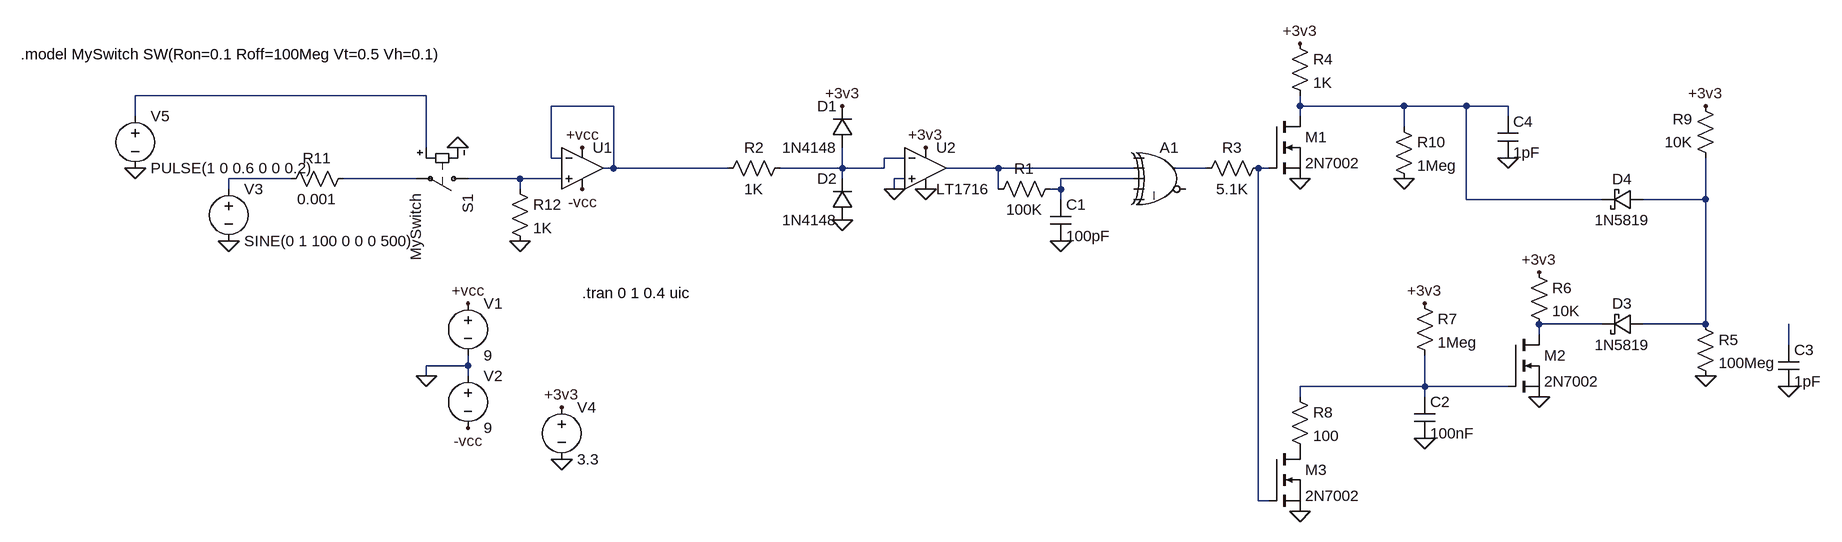
[diagram p0: schematic Revised Zero Crossing Detector.asc]
Revised Zero Crossing Detector.asc, the LTspice schematic file:
Version 4
SHEET 1 2064 932
WIRE -112 208 -560 208
WIRE 176 224 80 224
WIRE 1232 224 1232 208
WIRE 1392 224 1232 224
WIRE 1488 224 1392 224
WIRE 1552 224 1488 224
WIRE -560 240 -560 208
WIRE 1232 240 1232 224
WIRE 1552 240 1552 224
WIRE 1392 256 1392 224
WIRE -112 288 -112 208
WIRE 80 304 80 224
WIRE 96 304 80 304
WIRE 624 304 592 304
WIRE 176 320 176 224
WIRE 176 320 160 320
WIRE 352 320 176 320
WIRE 528 320 528 288
WIRE 528 320 432 320
WIRE 592 320 592 304
WIRE 592 320 528 320
WIRE 768 320 688 320
WIRE 976 320 768 320
WIRE 1088 320 1040 320
WIRE 1184 320 1168 320
WIRE -320 336 -416 336
WIRE -128 336 -240 336
WIRE 32 336 -48 336
WIRE 96 336 32 336
WIRE 528 336 528 320
WIRE 624 336 608 336
WIRE 976 336 864 336
WIRE -416 352 -416 336
WIRE 32 352 32 336
WIRE 608 352 608 336
WIRE 768 352 768 320
WIRE 864 352 864 336
WIRE 864 352 848 352
WIRE 864 368 864 352
WIRE 1488 368 1488 224
WIRE 1696 368 1488 368
WIRE 1856 368 1856 304
WIRE 1856 368 1760 368
WIRE 1696 560 1600 560
WIRE 1856 560 1856 368
WIRE 1856 560 1760 560
WIRE 1600 576 1600 560
WIRE 1984 592 1984 560
WIRE -48 624 -48 608
WIRE -48 624 -112 624
WIRE -112 640 -112 624
WIRE -48 640 -48 624
WIRE 1424 656 1424 608
WIRE 1424 656 1232 656
WIRE 1552 656 1424 656
WIRE 1232 672 1232 656
WIRE 1424 672 1424 656
WIRE 1168 832 1168 320
WIRE 1184 832 1168 832
FLAG -112 640 0
FLAG -48 528 +vcc
FLAG -48 720 -vcc
FLAG 128 352 -vcc
FLAG 128 288 +vcc
FLAG 608 352 0
FLAG -416 432 0
FLAG 96 768 0
FLAG 96 688 +3v3
FLAG 864 432 0
FLAG 528 400 0
FLAG 528 224 +3v3
FLAG 1232 336 0
FLAG 1232 128 +3v3
FLAG 656 352 0
FLAG 656 288 +3v3
FLAG 1424 736 0
FLAG 1600 672 0
FLAG 1600 480 +3v3
FLAG 1424 528 +3v3
FLAG 1232 848 0
FLAG 1856 224 +3v3
FLAG 1856 640 0
FLAG 1984 656 0
FLAG 1392 336 0
FLAG 1552 304 0
FLAG -560 320 0
FLAG -64 288 0
FLAG 32 432 0
SYMBOL OpAmps/UniversalOpAmp2 128 320 R0
SYMATTR InstName U1
SYMBOL Comparators/LT1716 656 320 R0
SYMATTR InstName U2
SYMBOL voltage -48 512 R0
SYMATTR InstName V1
SYMATTR Value 9
SYMBOL voltage -48 624 R0
SYMATTR InstName V2
SYMATTR Value 9
SYMBOL voltage -416 336 R0
SYMATTR InstName V3
SYMATTR Value SINE(0 1 100 0 0 0 500)
SYMATTR Value2 AC 1
SYMBOL Digital/xor 1024 272 R0
WINDOW 3 16 46 Left 2
SYMATTR InstName A1
SYMATTR SpiceLine Vhigh=3.3
SYMBOL voltage 96 672 R0
SYMATTR InstName V4
SYMATTR Value 3.3
SYMBOL Res 864 336 R90
WINDOW 0 0 56 VBottom 2
WINDOW 3 32 56 VTop 2
SYMATTR InstName R1
SYMATTR Value 100K
SYMBOL Cap 848 368 R0
SYMATTR InstName C1
SYMATTR Value 100pF
SYMBOL diode 544 288 R180
WINDOW 0 24 64 Left 2
WINDOW 3 24 0 Left 2
SYMATTR InstName D1
SYMATTR Value 1N4148
SYMBOL diode 544 400 R180
WINDOW 0 24 64 Left 2
WINDOW 3 24 0 Left 2
SYMATTR InstName D2
SYMATTR Value 1N4148
SYMBOL Res 448 304 R90
WINDOW 0 0 56 VBottom 2
WINDOW 3 32 56 VTop 2
SYMATTR InstName R2
SYMATTR Value 1K
SYMBOL nmos 1184 240 R0
SYMATTR InstName M1
SYMATTR Value 2N7002
SYMBOL Res 1216 112 R0
SYMATTR InstName R4
SYMATTR Value 1K
SYMBOL Res 1184 304 R90
WINDOW 0 0 56 VBottom 2
WINDOW 3 32 56 VTop 2
SYMATTR InstName R3
SYMATTR Value 5.1K
SYMBOL Cap 1408 672 R0
SYMATTR InstName C2
SYMATTR Value 100nF
SYMBOL Res 1584 464 R0
SYMATTR InstName R6
SYMATTR Value 10K
SYMBOL nmos 1552 576 R0
SYMATTR InstName M2
SYMATTR Value 2N7002
SYMBOL Res 1408 512 R0
SYMATTR InstName R7
SYMATTR Value 1Meg
SYMBOL nmos 1184 752 R0
SYMATTR InstName M3
SYMATTR Value 2N7002
SYMBOL Res 1216 656 R0
SYMATTR InstName R8
SYMATTR Value 100
SYMBOL schottky 1760 544 R90
WINDOW 0 0 32 VBottom 2
WINDOW 3 32 32 VTop 2
SYMATTR InstName D3
SYMATTR Value 1N5819
SYMATTR Description Diode
SYMATTR Type diode
SYMBOL Res 1872 320 R180
WINDOW 0 36 76 Left 2
WINDOW 3 36 40 Left 2
SYMATTR InstName R9
SYMATTR Value 10K
SYMBOL schottky 1760 352 R90
WINDOW 0 0 32 VBottom 2
WINDOW 3 32 32 VTop 2
SYMATTR InstName D4
SYMATTR Value 1N5819
SYMATTR Description Diode
SYMATTR Type diode
SYMBOL Res 1840 544 R0
SYMATTR InstName R5
SYMATTR Value 100Meg
SYMBOL Cap 1968 592 R0
SYMATTR InstName C3
SYMATTR Value 1pF
SYMBOL Res 1376 240 R0
SYMATTR InstName R10
SYMATTR Value 1Meg
SYMBOL Cap 1536 240 R0
SYMATTR InstName C4
SYMATTR Value 1pF
SYMBOL Res -224 320 R90
WINDOW 0 0 56 VBottom 2
WINDOW 3 32 56 VTop 2
SYMATTR InstName R11
SYMATTR Value 0.001
SYMBOL sw -32 336 R90
SYMATTR InstName S1
SYMATTR Value MySwitch
SYMBOL voltage -560 224 R0
SYMATTR InstName V5
SYMATTR Value PULSE(1 0 0.6 0 0 0.2)
SYMBOL Res 16 336 R0
SYMATTR InstName R12
SYMATTR Value 1K
TEXT 128 512 Left 2 !.tran 0 1 0.4 uic
TEXT -736 144 Left 2 !.model MySwitch SW(Ron=0.1 Roff=100Meg Vt=0.5 Vh=0.1)

The netlist it stands for:
* Revised Zero Crossing Detector.asc
XU1 N010 N002 +vcc -vcc N002 level2 Avol=1Meg GBW=10Meg Slew=10Meg Ilimit=25m Rail=0 Vos=0 En=0 Enk=0 In=0 Ink=0 Rin=500Meg  ; pins In+ In- V+ V- OUT
XU2 0 N004 +3v3 0 N005 LT1716  ; pins In+ In- V+ V- OUT
V1 +vcc 0 9
V2 0 -vcc 9
V3 N008 0 SINE(0 1 100 0 0 0 500) AC 1
A1 0 N005 N011 0 0 0 N006 0 XOR Vhigh=3.3
V4 +3v3 0 3.3
R1 N011 N005 100K
C1 N011 0 100pF
D1 N004 +3v3 1N4148
D2 0 N004 1N4148
R2 N004 N002 1K
M1 N003 N007 0 0 2N7002
R4 +3v3 N003 1K
R3 N007 N006 5.1K
C2 N015 0 100nF
R6 +3v3 N013 10K
M2 N013 N015 0 0 2N7002
R7 +3v3 N015 1Meg
M3 P001 N007 0 0 2N7002
R8 N015 P001 100
D3 N012 N013 1N5819
R9 N012 +3v3 10K
D4 N012 N003 1N5819
R5 N012 0 100Meg
C3 N014 0 1pF
R10 N003 0 1Meg
C4 N003 0 1pF
R11 N009 N008 0.001
S1 N010 N009 N001 0 MySwitch
V5 N001 0 PULSE(1 0 0.6 0 0 0.2)
R12 N010 0 1K
.model D D
.lib standard.dio
.model NMOS NMOS
.model PMOS PMOS
.lib standard.mos
.tran 0 1 0.4 uic
.model MySwitch SW(Ron=0.1 Roff=100Meg Vt=0.5 Vh=0.1)
.lib UniversalOpAmp2.lib
.lib LTC1.lib
.backanno
.end